# Altium schematic sheet reed_switch.SchDoc
size A3; SheetNumber: 2; SheetTotal: 2
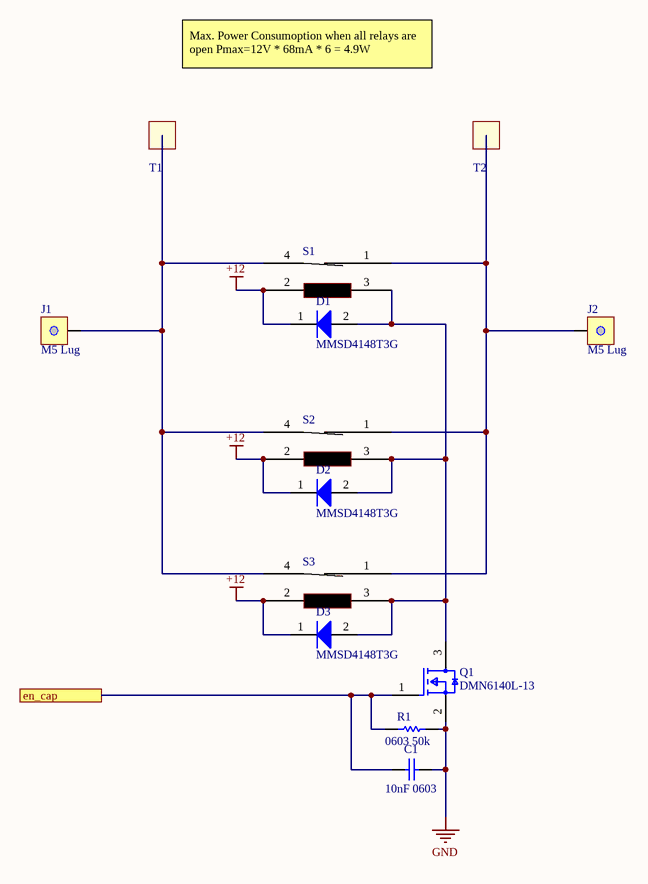
[diagram p0: reed_switch.SchDoc]

## Parts
C1  10nF 0603  [CAP 0603_1608]
D1  MMSD4148T3G  [ONSC-SOD-123-2-425-04_V]
D2  MMSD4148T3G  [ONSC-SOD-123-2-425-04_V]
D3  MMSD4148T3G  [ONSC-SOD-123-2-425-04_V]
J1  M5 Lug  [lug_pad_10mm_m5]
J2  M5 Lug  [lug_pad_10mm_m5]
Q1  DMN6140L-13  [FP-SOT23-MFG]
R1  0603 50k  [RES 0603_1608]
S1  Reed Relay 5A 3500kV / 7500kV (AC & DC)  [reed_relay_comus_3350-4275-126]  (value not drawn)
S2  Reed Relay 5A 3500kV / 7500kV (AC & DC)  [reed_relay_comus_3350-4275-126]  (value not drawn)
S3  Reed Relay 5A 3500kV / 7500kV (AC & DC)  [reed_relay_comus_3350-4275-126]  (value not drawn)
T1  pwr_connector_quick  [pcb_quick_power_connector]  (value not drawn)
T2  pwr_connector_quick  [pcb_quick_power_connector]  (value not drawn)

## Ports
en_cap

## Nets
+12: D1.1(K) D2.1(K) D3.1(K) S1.2 S2.2 S3.2
GND: C1.2 Q1.2(S) R1.2
en_cap: C1.1 Q1.1(G) R1.1 ; port en_cap
NetD1_2: D1.2(A) D2.2(A) D3.2(A) Q1.3(D) S1.3 S2.3 S3.3
NetJ1_1: J1.1 S1.4 S2.4 S3.4 T1.1
NetJ2_1: J2.1 S1.1 S2.1 S3.1 T2.1

## Notes on the sheet
- Max. Power Consumoption when all relays are open Pmax=12V * 68mA * 6 = 4.9W
- 1
- 2
- 3
- 4
- 5
- 6
- 7
- 8
- A
- B
- C
- D
- Project:
- Date:
- Drawing number:
- Rev:
- Format:
- A3
- Drawn by:
- Laboratory:
- Page
- Sheet:
- of
- File:

## Library data of the parts
C1 = Cap: Capacitor; Published: 8-Jun-2000; LatestRevisionDate: 17-Jul-2002; LatestRevisionNote: Re-released for DXP Platform.; PackageReference: RAD-0.3; Publisher: Altium Limited; PackageDescription: Radial Cap, Thru-Hole; 2 Leads; 0.3 in Pin Spacing; Value: 10nF
D1-D3 = CMP-0895-00002-2: Switching Diode, 2-Pin SOD-123, Pb-Free, Tape and Reel; Manufacturer: On Semiconductor; Configuration: Single; trr Max (ns): 4; IF Max (A): 0.2; ComponentLink1Description: Manufacturer URL; PackageReference: SOD-123-2-425-04; ComponentLink2Description: Datasheet; PackageVersion: Rev. G, 10/2009; PartNumber: MMSD4148T3G; ComponentLink3Description: Package Specification; ComponentLink1URL: http://www.onsemi.com/; PackageDescription: 2-Pin SOD, Body 1.6 x 2.69 mm; DatasheetVersion: Rev. 11; Packing: Tape and Reel; RoHS: TRUE; ComponentLink2URL: http://www.onsemi.com/pub_link/Collateral/MMSD4148T1-D.PDF; Mounting Technology: Surface Mount; ComponentLink3URL: http://www.onsemi.com/pub_link/Collateral/425-04.PDF
J1 J2 = lug_pad_10mm_m5
Q1 = CMP-12801-000047-1: MOSFET N-CH 60V 1.6A SOT23; Manufacturer: Diodes Inc.; Turn Off Delay Time: 16.3ns; Power Dissipation: 0.7W; Pulse Drain Current: 10A; Number Of Channels: 1; Reverse Recovery Time: 16.8ns; Typ Forward Diode Voltage: 0.75V; Gate To Source Voltage: 20V; Rthja Max: 183°C/W; Gate Charge At Vgs: 8.6nC @ 10V; Drain To Source Resistance: 92mΩ; Depletion Mode: False; Max Junction Temp: +150°C; Max Forward Diode Voltage: 1V; Reverse Recovery Charge: 9nC; Input Capacitace At Vds: 315pF @ 40V; Standoff Height: 0.013mm; Threshold Vgs Max: 3V; Turn On Delay Time: 2.6ns; Mouser Description: MOSFET 31V to 99V N-Ch FET 60Vds 20Vgs 2.3A; ComponentLink2Description: Datasheet; Digikey Description: MOSFET N-CH 60V 1.6A SOT23; Lead Free: Yes; Category: Trans; Device Class L3: MOSFETs; Temperature Range High: +150°C; Octopart: https://octopart.com/dmn6140l-13-diodes+inc.-38898616; Drain To Source Voltage: 60V; ComponentLink2URL: https://www.diodes.com/assets/Datasheets/DMN6140L.pdf; Drain To Source Breakdown Voltage: 60V; Footprint Url: https://www.diodes.com/assets/Package-Files/SOT23.pdf; Package: SOT23; Continuous Drain Current: 1.6A; Device Class L1: Discrete Semiconductors; Device Class L2: Transistors; Number Of N Channels: 1; Temperature Range Low: -55°C; Height: 1.1mm; Manufacturer Part Number: DMN6140L-13; RoHS: TRUE; Temperature: -55°C to +150°C; Threshold Vgs Min: 1V; Automotive: No
R1 = Res1: Resistor; Published: 8-Jun-2000; LatestRevisionDate: 17-Jul-2002; LatestRevisionNote: Re-released for DXP Platform.; PackageReference: AXIAL-0.3; Publisher: Altium Limited; PackageDescription: Axial Device, Thru-Hole; 2 Leads; 0.3 in Pin Spacing; Value: 50k
S1-S3 = reed_relay_3350-4275-126: 3500kV (AC & DC) breaking capacity @ 200W / 7500kV (AC & DC) minimum dielectric strength; Supplier 1: Digi-Key; Supplier Part Number 1: 1835-1040-ND
T1 T2 = pwr_connector_quick: Supplier 1: Digi-Key; Supplier Part Number 1: WM2984CT-ND